# Altium schematic sheet STM32F030F4_Mini.SchDoc
size A4
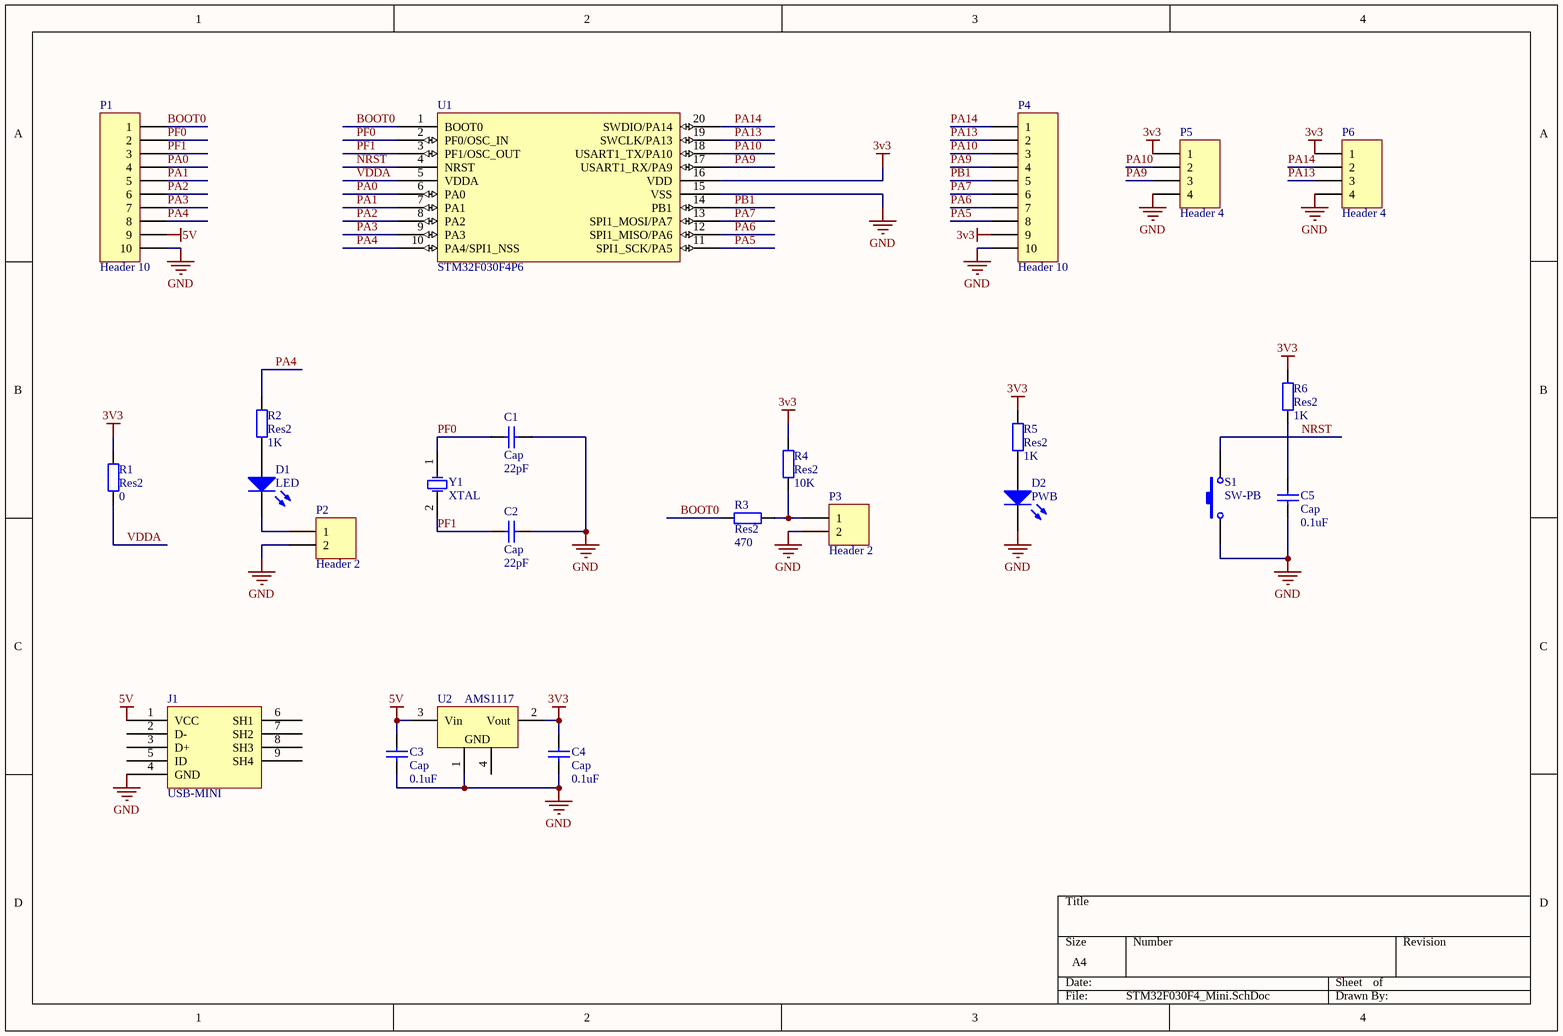
[diagram p0: STM32F030F4_Mini.SchDoc]

## Parts
C1  Cap  value 22pF  [6-0805_M]
C2  Cap  value 22pF  [6-0805_M]
C3  Cap  value 0.1uF  [6-0805_M]
C4  Cap  value 0.1uF  [6-0805_M]
C5  Cap  value 0.1uF  [6-0805_M]
D1  LED  [6-0805_M]
D2  PWB  [6-0805_M]
J1  USB-MINI  [USB-SM]
P1  Header 10  [HDR1X10]
P2  Header 2  [HDR1X2]
P3  Header 2  [HDR1X2]
P4  Header 10  [HDR1X10]
P5  Header 4  [HDR1X4]
P6  Header 4  [HDR1X4]
R1  Res2  value 0  [HDR1X2]
R2  Res2  value 1K  [6-0805_M]
R3  Res2  value 470  [6-0805_M]
R4  Res2  value 10K  [6-0805_M]
R5  Res2  value 1K  [6-0805_M]
R6  Res2  value 1K  [6-0805_M]
S1  SW-PB  [SPST-2(6*3.5) - SM]
U1  STM32F030F4P6  [TSSOP20]
U2  AMS1117  [SOT-223]
Y1  XTAL  [XTAL1]

## Nets
3V3: C4.2 P4.9 P5.1 P6.1 R1.1 R4.1 R5.1 R6.1 U1.16(VDD) U2.2(Vout)
5V: C3.2 J1.1(VCC) P1.9 U2.3(Vin)
GND: C1.1 C2.1 C3.1 C4.1 C5.2 D2.2(K) J1.4(GND) P1.10 P2.2 P3.2 P4.10 P5.4 P6.4 S1.1 U1.15(VSS) U2.1(GND)
BOOT0: P1.1 R3.1 U1.1(BOOT0)
NRST: S1.2 U1.4(NRST)
PA0: P1.4 U1.6(PA0)
PA1: P1.5 U1.7(PA1)
PA2: P1.6 U1.8(PA2)
PA3: P1.7 U1.9(PA3)
PA4: P1.8 R2.2 U1.10(PA4/SPI1_NSS)
PA5: P4.8 U1.11(SPI1_SCK/PA5)
PA6: P4.7 U1.12(SPI1_MISO/PA6)
PA7: P4.6 U1.13(SPI1_MOSI/PA7)
PA9: P4.4 P5.3 U1.17(USART1_RX/PA9)
PA10: P4.3 P5.2 U1.18(USART1_TX/PA10)
PA13: P4.2 P6.3 U1.19(SWCLK/PA13)
PA14: P4.1 P6.2 U1.20(SWDIO/PA14)
PB1: P4.5 U1.14(PB1)
PF0: C1.2 P1.2 U1.2(PF0/OSC_IN) Y1.1(OSC1)
PF1: C2.2 P1.3 U1.3(PF1/OSC_OUT) Y1.2(OSC2)
VDDA: R1.2 U1.5(VDDA)
NetC5_1: C5.1 R6.2
NetD1_1: D1.1(A) R2.1
NetD1_2: D1.2(K) P2.1
NetD2_1: D2.1(A) R5.2
NetP3_1: P3.1 R3.2 R4.2

Not connected (* = marked no-connect by the designer): J1 2(D-) 3(D+) 5(ID) 6(SH1) 7(SH2) 8(SH3) 9(SH4); U2 4(GND)

## Library data of the parts
C1-C5 = Cap: Capacitor; Published: 8-Jun-2000; LatestRevisionDate: 17-Jul-2002; LatestRevisionNote: Re-released for DXP Platform.; PackageReference: RAD-0.3; Publisher: Altium Limited; PackageDescription: Radial Cap, Thru-Hole; 2 Leads; 0.3 in Pin Spacing
D1 D2 = LED-2P: 发光二极管
P1 P4 = Header 10: Header, 10-Pin; LatestRevisionDate: 17-Jul-2002; LatestRevisionNote: Re-released for DXP Platform.; Publisher: Altium Limited
P2 P3 = Header 2: Header, 2-Pin; LatestRevisionDate: 17-Jul-2002; LatestRevisionNote: Re-released for DXP Platform.; Publisher: Altium Limited
P5 P6 = Header 4: Header, 4-Pin; LatestRevisionDate: 17-Jul-2002; LatestRevisionNote: Re-released for DXP Platform.; Publisher: Altium Limited
R1-R6 = Res2: Resistor; Published: 8-Jun-2000; LatestRevisionDate: 17-Jul-2002; LatestRevisionNote: Re-released for DXP Platform.; PackageReference: AXIAL-0.4; Publisher: Altium Limited; PackageDescription: Axial Device, Thru-Hole; 2 Leads; 0.4 in Pin Spacing
S1 = SW-PB: Switch; Published: 24-Mar-1999; LatestRevisionDate: 17-Jul-2002; LatestRevisionNote: Re-released for DXP Platform.; PackageReference: SPST-2; Publisher: Altium Limited; PackageDescription: Switch; 2 Leads
U1 = STM32F030F4P6: STM32F0
U2 = AMS1117: 低压稳压器-1A
Y1 = XTAL: Crystal Oscillator; Published: 8-Jun-2000; LatestRevisionDate: 17-Jul-2002; LatestRevisionNote: Re-released for DXP Platform.; PackageReference: R38; Publisher: Altium Limited; PackageDescription: Crystal, Thru-Hole; 2 Leads; Body 3.1 x 8.2 mm (Dia.xH)